# EasyEDA schematic SCH_Trabajo TEC.json
TITLE: Trabajo TEC Omar y Raul; REV: 1.0; Date: 11/12/2021; Sheet: 1/1; Drawn By: Omar y Raul
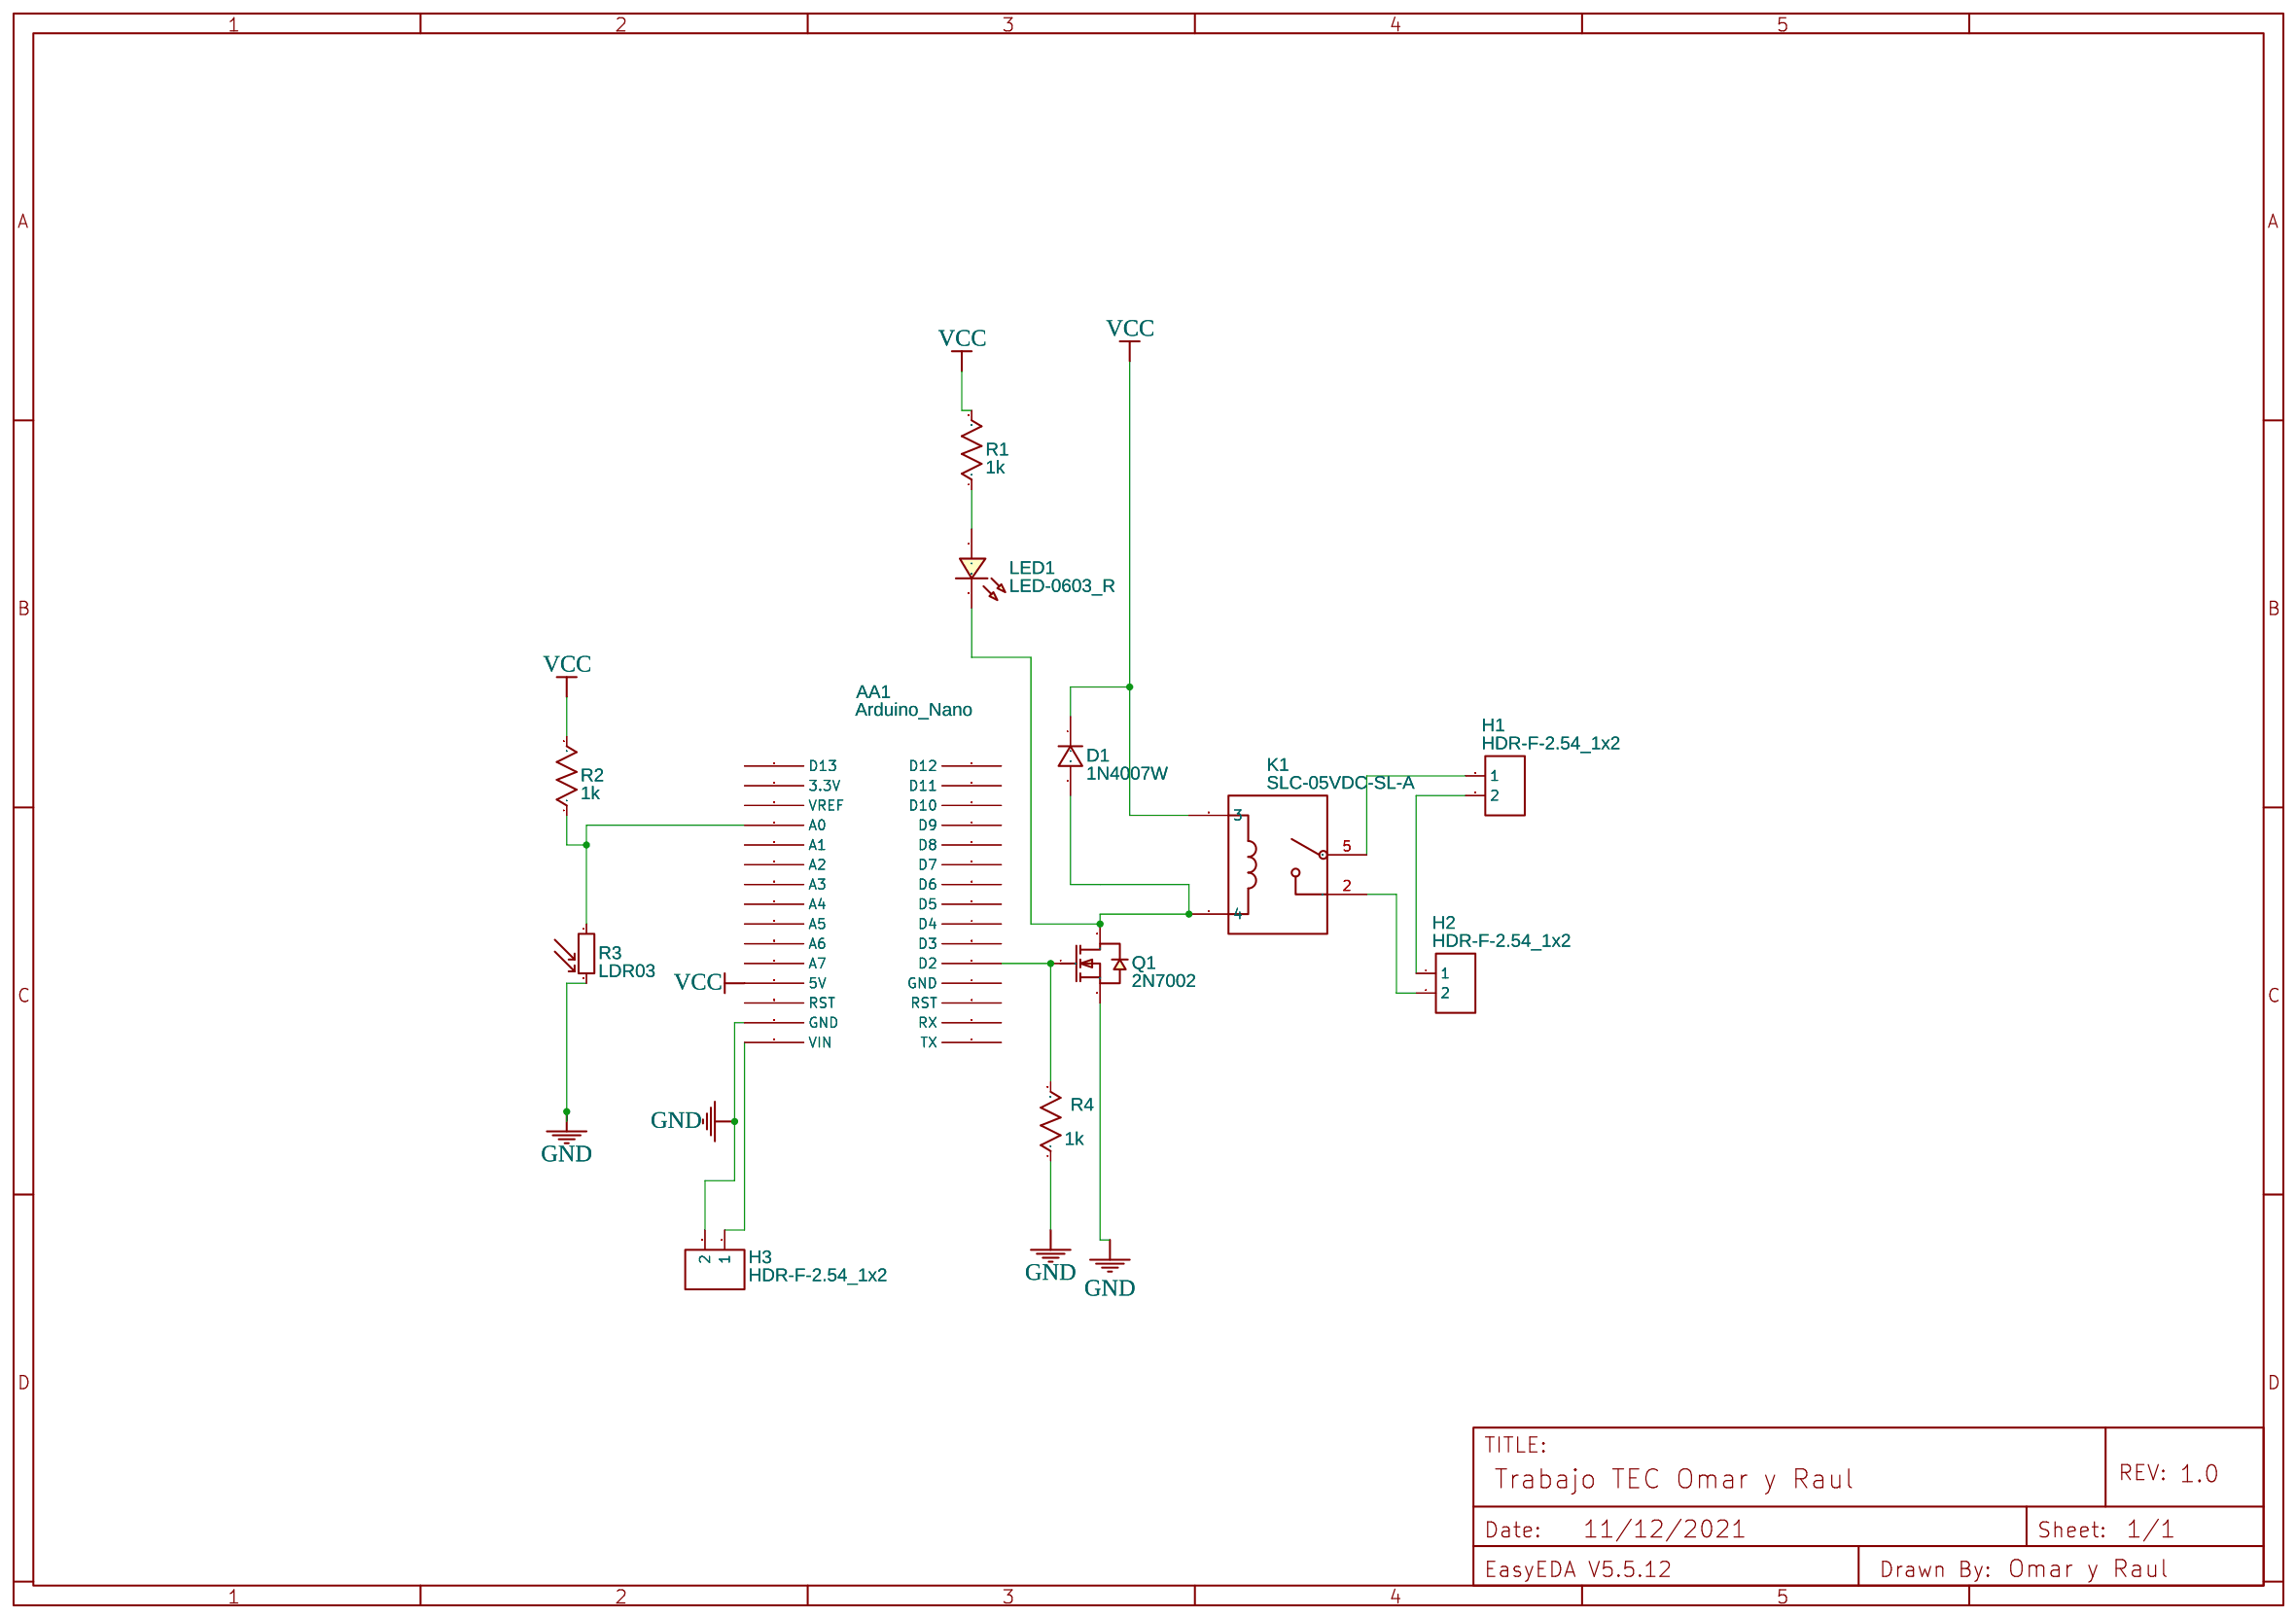
[diagram p0: schematic sheet]

## Parts
AA1  Arduino_Nano  [ARDUINO_NANO WITH MOUNTING HOLES]
D1  1N4007W  [SOD-123_L2.8-W1.8-LS3.7-RD]
H1  HDR-F-2.54_1x2  [HDR-F-2.54_1X2]
H2  HDR-F-2.54_1x2  [HDR-F-2.54_1X2]
H3  HDR-F-2.54_1x2  [HDR-F-2.54_1X2]
K1  SLC-05VDC-SL-A  [RELAY-TH_SLC-05VDC-SL-A]
LED1  LED-0603_R  [LED0603_RED]
Q1  2N7002  [SOT-23_L2.9-W1.3-P0.95-LS2.4-BR]
R1  1k  [R0603]
R2  1k  [R0603]
R3  LDR03  [RESISTOR_LDR_10X8.5_RM7.6]
R4  1k  [R0603]

## Library data of the parts
AA1 = -: Manufacturer Part: Arduino Nano; Contributor: CowboyWillT
D1 = 1N4007W: Supplier: LCSC; Supplier Part: C328592; Manufacturer: BLUE ROCKET; Contributor: LCEDA_Lib
H1-H3 = HDR-F-2.54_1x2: Supplier Part: C49661; Supplier: LCSC; Contributor: LCEDA_Lib
K1 = SLC-05VDC-SL-A: Supplier: LCSC; Supplier Part: C187903; Manufacturer: Ningbo Songle Relay; Contributor: LCSC; JLCPCB Part Class: Extended Part
LED1 = LED-0603_R: Manufacturer: EVERLIGHT(台湾亿光); Manufacturer Part: 19-217/R6C-AL1M2VY/3T; Supplier Part: C72044; Supplier: LCSC; Contributor: LCEDA_01
Q1 = 2N7002: Supplier: LCSC; Manufacturer: Nexperia; Manufacturer Part: 2N7002,215; image: //image.lceda.cn/szlcsc/C65189.jpg; Supplier Part: C65189; Paste Type: expand; Contributor: LCEDA_Lib
R1 R2 R4 = R_0603_US: Contributor: LCEDA_Lib
R3 = LDR03: Contributor: KiCAD; license: https://www.gnu.org/licenses/lgpl-2.1.html

## Nets
GND: AA1.29(GND) H3.2 Q1.2(S) R3.2 R4.1
VCC: AA1.27(5V) D1.1 K1.3 R1.2 R2.2
Net-(AA1-5): AA1.5(D2) Q1.1(G) R4.2
Net-(AA1-19): AA1.19(A0) R2.1 R3.1
Net-(AA1-30): AA1.30(VIN) H3.1
Net-(D1-2): D1.2 K1.4 LED1.2 Q1.3(D)
Net-(H1-1): H1.1 K1.5
Net-(H1-2): H1.2 H2.1
Net-(H2-2): H2.2 K1.2
Net-(LED1-1): LED1.1 R1.1

Not connected (* = marked no-connect by the designer): AA1 1(TX) 2(RX) 3(RST) 4(GND) 6(D3) 7(D4) 8(D5) 9(D6) 10(D7) 11(D8) 12(D9) 13(D10) 14(D11) 15(D12) 16(D13) 17(3.3V) 18(VREF) 20(A1) 21(A2) 22(A3) 23(A4) 24(A5) 25(A6) 26(A7) 28(RST)
